# EAGLE design Esquema 2 mosfets (EAGLE 9.6.2)
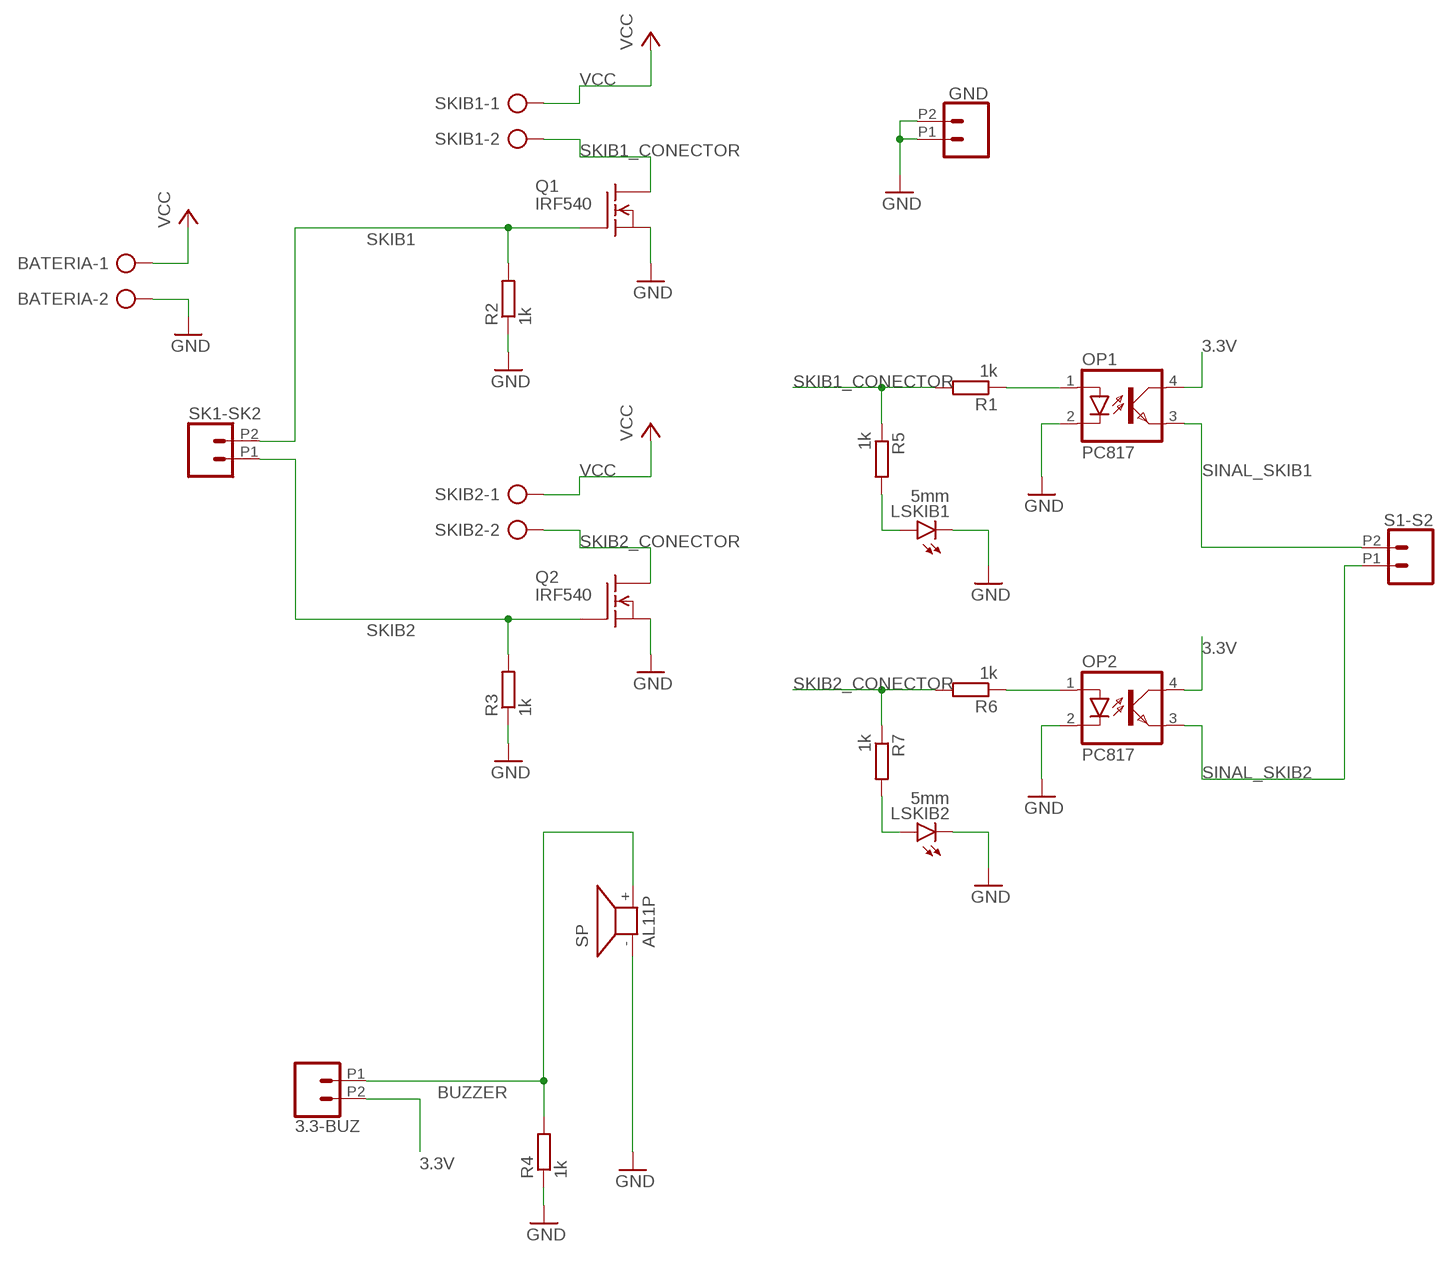
[diagram p0: schematic, sheet 1]

## Parts
3.3-BUZ  CONN_022.54MM_SCREWTERM  [1X02_2.54_SCREWTERM]
BATERIA  AK500/2-H  [AK500/2-H]
GND  CONN_022.54MM_SCREWTERM  [1X02_2.54_SCREWTERM]
LSKIB1  5mm  LED5MM  [LED5MM]
LSKIB2  5mm  LED5MM  [LED5MM]
OP1  PC817  [DIL04]
OP2  PC817  [DIL04]
Q1  IRF540  [TO220]
Q2  IRF540  [TO220]
R1  1k  R-EU_0207/10  [0207/10]
R2  1k  R-EU_0207/10  [0207/10]
R3  1k  R-EU_0207/10  [0207/10]
R4  1k  R-EU_0207/10  [0207/10]
R5  1k  R-EU_0207/10  [0207/10]
R6  1k  R-EU_0207/10  [0207/10]
R7  1k  R-EU_0207/10  [0207/10]
S1-S2  CONN_022.54MM_SCREWTERM  [1X02_2.54_SCREWTERM]
SK1-SK2  CONN_022.54MM_SCREWTERM  [1X02_2.54_SCREWTERM]
SKIB1  AK500/2-H  [AK500/2-H]
SKIB2  AK500/2-H  [AK500/2-H]
SP  AL11P  [AL11P]

## Nets
3.3V: 3.3-BUZ.P2 OP1.4(COL) OP2.4(COL)
BUZZER: 3.3-BUZ.P1 R4.2 SP.+
GND: BATERIA.2 LSKIB1.K(C) LSKIB2.K(C) OP1.2(C) OP2.2(C) Q1.3(S) Q2.3(S) R2.1 R3.1 R4.1 SP.-
N$1: LSKIB2.A R7.2
N$2: GND.P1 GND.P2 ; supply symbol labelled GND
N$3: LSKIB1.A R5.2
N$4: OP1.1(A) R1.1
N$5: OP2.1(A) R6.1
SINAL_SKIB1: OP1.3(EMIT) S1-S2.P2
SINAL_SKIB2: OP2.3(EMIT) S1-S2.P1
SKIB1: Q1.1(G) R2.2 SK1-SK2.P2
SKIB1_CONECTOR: Q1.2(D) R1.2 R5.1 SKIB1.2
SKIB2: Q2.1(G) R3.2 SK1-SK2.P1
SKIB2_CONECTOR: Q2.2(D) R6.2 R7.1 SKIB2.2
VCC: BATERIA.1 SKIB1.1 SKIB2.1

## Library data of the parts
3.3-BUZ GND S1-S2 SK1-SK2 = SparkFun-Connectors:CONN_02: Multi connection point. Often used as Generic Header-pin footprint for 0.1 inch spaced/style header connections On any of the 0.1 inch spaced packages, you can populate with these: Break Away Headers - Straight <https://www.sparkfun.com/products/116> (PRT-00116) Break Away Male Headers - Right Angle <https://www.sparkfun.com/products/553> (PRT-00553) Female Headers <https://www.sparkfun.com/products/115> (PRT-00115) Break Away Headers - Machine Pin <https://www.sparkfun.com/products/117> (PRT-00117) Break Away Female Headers - Swiss Machine Pin <https://www.sparkfun.com/products/743> (PRT-00743) For SCREWTERMINALS and SPRING TERMINALS visit here: Screw Terimnals on SparkFun.com <https://www.sparkfun.com/search/results?term=Screw+Terminals> (5mm/3.5mm/2.54mm spacing) This device is also useful as a general connection point to wire up your design to another part of your project. Our various solder wires solder well into these plated through hole pads. Hook-Up Wire - Assortment (Stranded, 22 AWG) <https://www.sparkfun.com/products/11375> (PRT-11375) Hook-Up Wire - Assortment (Solid Core, 22 AWG) <https://www.sparkfun.com/products/11367> (PRT-11367) View the entire wire category on our website here <https://www.sparkfun.com/categories/141> Special notes: Molex polarized connector foot print use with: PRT-08233 with associated crimp pins and housings. 2.54_SCREWTERM for use with PRT-10571. 3.5mm Screw Terminal footprints for PRT-08084 5mm Screw Terminal footprints for use with PRT-08432
BATERIA SKIB1 SKIB2 = con-ptr500:AK500/2-H: CONNECTOR Aug. 2004 / PTR Meßtechnik: Die Bezeichnung der Serie AK505 wurde geändert. Es handelt sich hierbei um AK500 in horizontaler Ausführung.; OC_FARNELL: unknown; OC_NEWARK: unknown
LSKIB1 LSKIB2 = led:LED: LED OSRAM: - CHIPLED LG R971, LG N971, LY N971, LG Q971, LY Q971, LO R971, LY R971 LH N974, LH R974 LS Q976, LO Q976, LY Q976 LO Q996 - Hyper CHIPLED LW Q18S LB Q993, LB Q99A, LB R99A - SideLED LS A670, LO A670, LY A670, LG A670, LP A670 LB A673, LV A673, LT A673, LW A673 LH A674 LY A675 LS A676, LA A676, LO A676, LY A676, LW A676 LS A679, LY A679, LG A679 - Hyper Micro SIDELED® LS Y876, LA Y876, LO Y876, LY Y876 LT Y87S - SmartLED LW L88C, LW L88S LB L89C, LB L89S, LG L890 LS L89K, LO L89K, LY L89K LS L896, LA L896, LO L896, LY L896 - TOPLED LS T670, LO T670, LY T670, LG T670, LP T670 LSG T670, LSP T670, LSY T670, LOP T670, LYG T670 LG T671, LOG T671, LSG T671 LB T673, LV T673, LT T673, LW T673 LH T674 LS T676, LA T676, LO T676, LY T676, LB T676, LH T676, LSB T676, LW T676 LB T67C, LV T67C, LT T67C, LS T67K, LO T67K, LY T67K, LW E67C LS E67B, LA E67B, LO E67B, LY E67B, LB E67C, LV E67C, LT E67C LW T67C LS T679, LY T679, LG T679 LS T770, LO T770, LY T770, LG T770, LP T770 LB T773, LV T773, LT T773, LW T773 LH T774 LS E675, LA E675, LY E675, LS T675 LS T776, LA T776, LO T776, LY T776, LB T776 LHGB T686 LT T68C, LB T68C - Hyper Mini TOPLED® LB M676 - Mini TOPLED Santana® LG M470 LS M47K, LO M47K, LY M47K Source: http://www.osram.convergy.de LUXEON: - LUMILED® LXK2-PW12-R00, LXK2-PW12-S00, LXK2-PW14-U00, LXK2-PW14-V00 LXK2-PM12-R00, LXK2-PM12-S00, LXK2-PM14-U00 LXK2-PE12-Q00, LXK2-PE12-R00, LXK2-PE12-S00, LXK2-PE14-T00, LXK2-PE14-U00 LXK2-PB12-K00, LXK2-PB12-L00, LXK2-PB12-M00, LXK2-PB14-N00, LXK2-PB14-P00, LXK2-PB14-Q00 LXK2-PR12-L00, LXK2-PR12-M00, LXK2-PR14-Q00, LXK2-PR14-R00 LXK2-PD12-Q00, LXK2-PD12-R00, LXK2-PD12-S00 LXK2-PH12-R00, LXK2-PH12-S00 LXK2-PL12-P00, LXK2-PL12-Q00, LXK2-PL12-R00 Source: www.luxeon.com KINGBRIGHT: KA-3528ASYC Source: www.kingbright.com
OP1 OP2 = optocoupler:PC817: SHARP OPTO COUPLER; MPN: PC817X4J000F; OC_FARNELL: 9707727; OC_NEWARK: 97K7059
Q1 Q2 = transistor-fet:IRF540: N-Channel Enhancement MOSFET (HEXFET); 100V; 28A; 0,077Ohm
R1-R7 = rcl:R-EU_: RESISTOR, European symbol; SPICEPREFIX: R
SP = buzzer:AL11P: SPEAKER Source: Buerklin; OC_FARNELL: unknown; OC_NEWARK: unknown

## Board
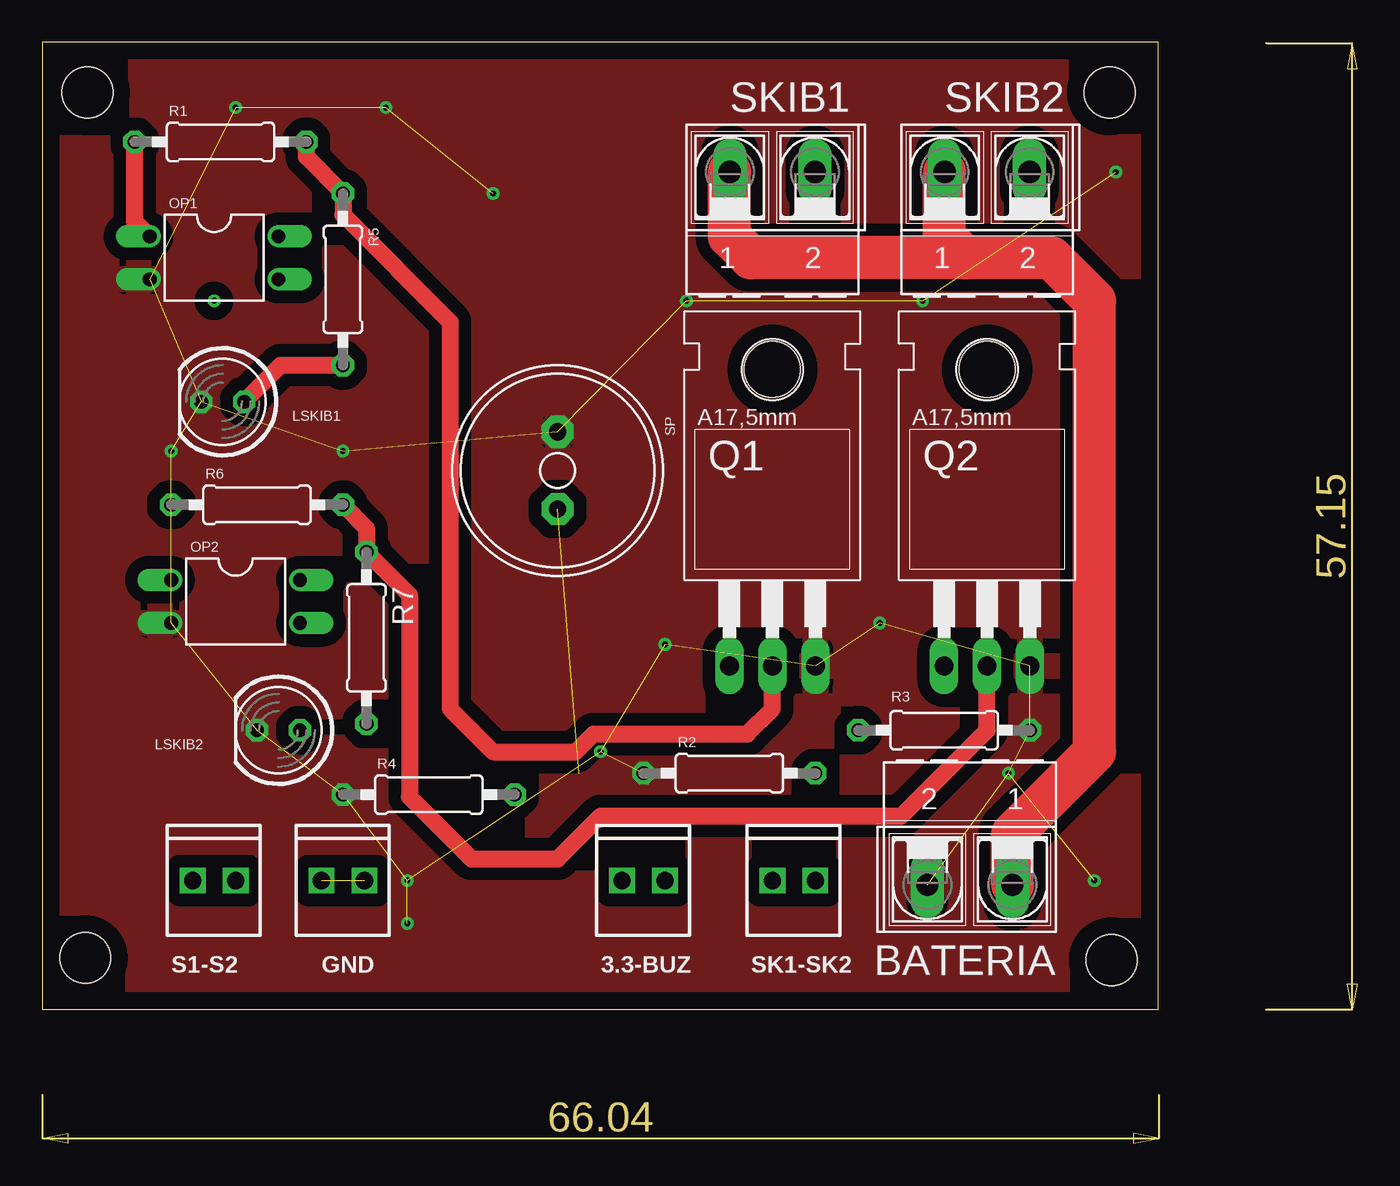
[diagram p1: board, top side]
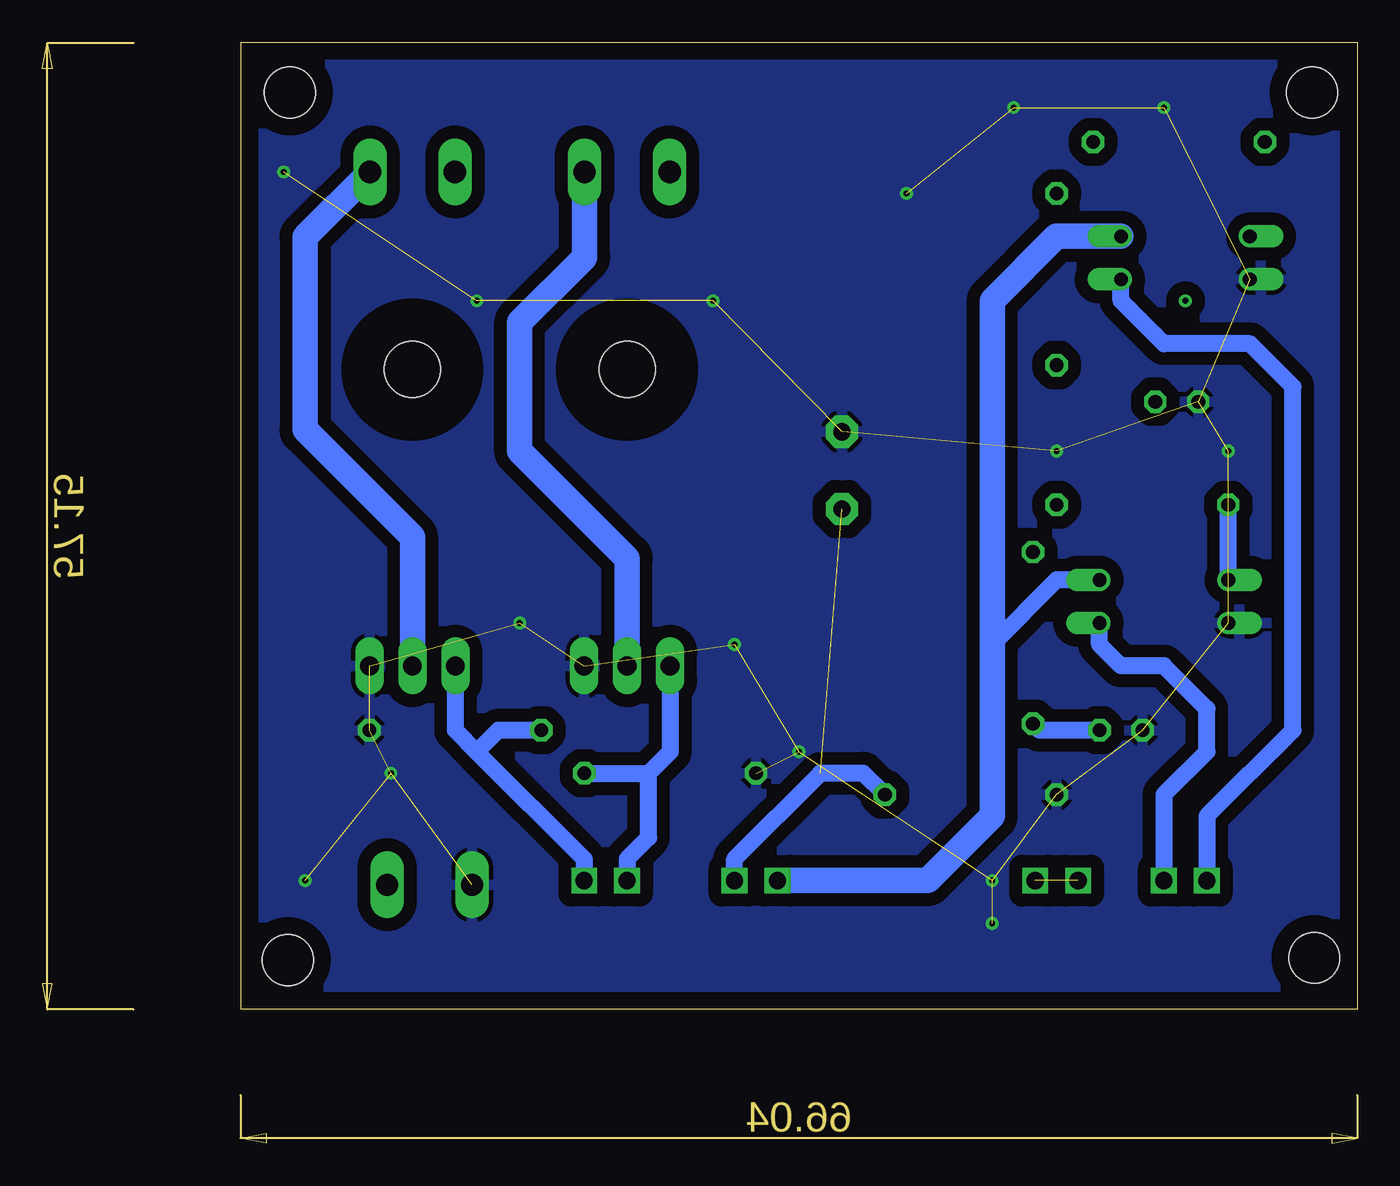
[diagram p2: board, bottom side, seen from below]

Size 66.02 x 57.2 mm. Coordinates in mm from the lower left corner, seen from the top.
Outline: 0,0 66.02,0 66.02,57.2 0,57.2 0,0
Copper layers (1*16): Top 0.035mm / dielectric 1.5mm / Bottom 0.035mm
Design rules "default *": minimum track width 1mm, minimum drill 0.35mm, track to track 30mil, track to pad 0.5mm, pad to pad 6mil, via to via 6mil, smd to smd 6mil, copper to edge 40mil, drill to drill 6mil, minimum pad ring 10mil, minimum via ring 8mil, stop-mask expansion 4mil, vias tented up to drill 1mm, thermal gap 10mil
Holes 3 mm at 2.67,54.23 63.12,54.23 2.54,3.05 63.25,2.92

### Footprints (pad centres in the part's own frame; a part is rotated, then mirrored left to right if it is on the bottom)
1X02_2.54_SCREWTERM = drill 1.016 square: P1 2.54,0; P2 0,0
AK500/2-H = drill 1.321 long: 1 -2.515,0; 2 2.515,0
LED5MM = drill 0.813 octagon: A -1.27,0; K 1.27,0
DIL04 = drill 0.813 offset: 1 -1.27,-3.81; 2 1.27,-3.81; 3 1.27,3.81; 4 -1.27,3.81
TO220 = drill 1.118 long: 1 -2.54,-6.35; 2 0,-6.35; 3 2.54,-6.35 | hole 3.302: 0,11.176
0207/10 = drill 0.813 octagon: 1 -5.08,0; 2 5.08,0
AL11P = drill 1.016 pad 1.905 octagon: + 2.286,0; - -2.286,0

### Placement (x,y rotation side)
3.3-BUZ  34.29,7.62 0 top
BATERIA  54.86,7.37 180 top
GND  16.51,7.62 0 top
LSKIB1  10.67,35.94 180 top
LSKIB2  13.97,16.51 180 top
OP1  10.16,44.45 270 top
OP2  11.43,24.13 270 top
Q1  43.18,26.67 0 top
Q2  55.88,26.67 0 top
R1  10.54,51.31 0 top
R2  40.64,13.97 0 top
R3  53.34,16.51 180 top
R4  22.86,12.7 0 top
R5  17.78,43.18 270 top
R6  12.7,29.84 0 top
R7  19.18,21.97 270 top
S1-S2  8.89,7.62 0 top
SK1-SK2  43.18,7.62 0 top
SKIB1  43.18,49.53 0 top
SKIB2  55.88,49.53 0 top
SP  30.48,31.88 270 top

### Tracks (layer width: path | path; a pad name or v marks a point on that pad's centre or on a via)
3.3V
  Bottom 1: 21.59,21.59 17.78,25.4 OP2.4
  Bottom 1.5: 3.3-BUZ.P2 25.4,7.62 21.59,11.43 21.59,21.59 21.59,41.91 17.78,45.72 OP1.4
BUZZER  (1 unrouted)
  Bottom 1: 3.3-BUZ.P1 36.83,8.89 31.75,13.97 29.21,13.97
  Bottom 1.016: R4.2 29.21,13.97
GND  (via drill 0.35)  (25 unrouted)
  other vias: 21.59,7.62 21.59,5.08 7.62,33.02 11.43,53.34 20.32,53.34 26.67,48.26 63.5,49.53 38.1,41.91 52.07,41.91 36.83,21.59 49.53,22.86 62.23,7.62 57.15,13.97 33.02,15.24 17.78,33.02
  pour Bottom: 0.38,56.77 0.38,0.38 65.66,0.38 65.66,56.77
  pour Top: 0,57.15 66.04,57.15 66.04,0 0,0
N$1
  Bottom 1: R7.2 18.8,16.51 LSKIB2.A
N$2  (1 unrouted)
N$3
  Top 1: LSKIB1.A 14.1,38.1 R5.2
N$4
  Top 1: OP1.1 5.46,46.61 R1.1
N$5
  Bottom 1: OP2.1 R6.1
N$8  (via drill 0.35)
  other vias: 10.16,41.91
SINAL_SKIB1
  Bottom 1: OP1.3 13.97,41.91 11.43,39.37 6.35,39.37 3.81,36.83 3.81,16.51 8.89,11.43 S1-S2.P2
SINAL_SKIB2
  Bottom 1: OP2.3 15.24,21.59 13.97,20.32 11.43,20.32 8.89,17.78 8.89,15.24 11.43,12.7 S1-S2.P1
SKIB1
  Bottom 1: 41.91,13.97 41.91,10.16 43.18,8.89 SK1-SK2.P2
  Bottom 1.016: R2.2 41.91,13.97 40.64,15.24 Q1.1
SKIB1_CONECTOR
  Top 1: R1.2 15.62,50.42 R5.1 17.78,46.99 24.13,40.64 24.13,17.78 25.4,16.51
  Top 1.016: 25.4,16.51 26.67,15.24 31.55,15.24 32.59,16.28 41.68,16.28 43.18,17.78 Q1.2
  Bottom 1.5: Q1.2 43.18,26.67 49.53,33.02 49.53,40.64 45.7,44.48 SKIB1.2
SKIB2
  Bottom 1: Q2.1 53.34,16.51 52.07,15.24 45.72,8.89 SK1-SK2.P1
  Bottom 1.016: R3.2 50.8,16.51 52.07,15.24
SKIB2_CONECTOR
  Top 1: R6.2 19.18,28.45 R7.1 21.72,24.51 21.72,12.57 25.4,8.89 30.48,8.89 33.02,11.43 50.8,11.43 55.88,16.51 Q2.2
  Bottom 1.5: SKIB2.2 62.23,45.7 62.23,34.29 55.88,27.94 Q2.2
VCC
  Top 2.54: BATERIA.1 57.38,10.39 62.23,15.24 62.23,41.91 59.69,44.45 54.61,44.45 | 54.61,44.45 53.37,45.7 SKIB2.1 | 54.61,44.45 41.91,44.45 40.64,45.72 40.64,49.53 SKIB1.1